# Altium schematic sheet 5PIN.schdoc
size 49 x 40 mm
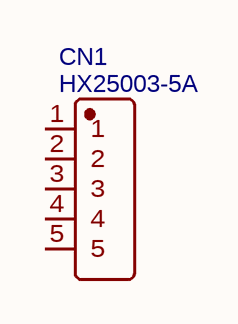
[diagram p0: 5PIN.schdoc]

## Parts
CN1  HX25003-5A  [CONN-TH_5P-P2.50_HX25003-5A]

## Nets

Not connected (* = marked no-connect by the designer): CN1 1 2 3 4 5

## Library data of the parts
CN1 = HX25003-5A: BOM_Manufacturer: HX(Zhejiang Yueqing Hongxing Elec); Contributor: LCSC; BOM_Supplier: LCSC; BOM_Supplier Part: C442302; BOM_Manufacturer Part: HX25003-5A; BOM_JLCPCB Part Class: Extended Part; spicePre: C; spiceSymbolName: HX25003-5A